# Altium project Common_AMC_Box.PrjPcb (part 4 of 6)

## Sheet Thermal_MGT.SchDoc: Temperature
size 420 x 297 mm; Author: G.Kasprowicz; CompanyName: WUT ISE; DrawnBy: G.Kasprowicz; Organization: WUT ISE; Address1: PW ISE; Address2: Nowowiejska 15/19 00-665 Warsaw; Address3: gkasprow@gmail.com; DocumentNumber: 12; Revision: 2; SheetNumber: 12; SheetTotal: 18; ModifiedBy: -; CheckedDate: -; Title2: management; DivGrp: WUT ISE; Designer: G.Kasprowicz; ModifiedDate: -; ProjectName: Sensor Box
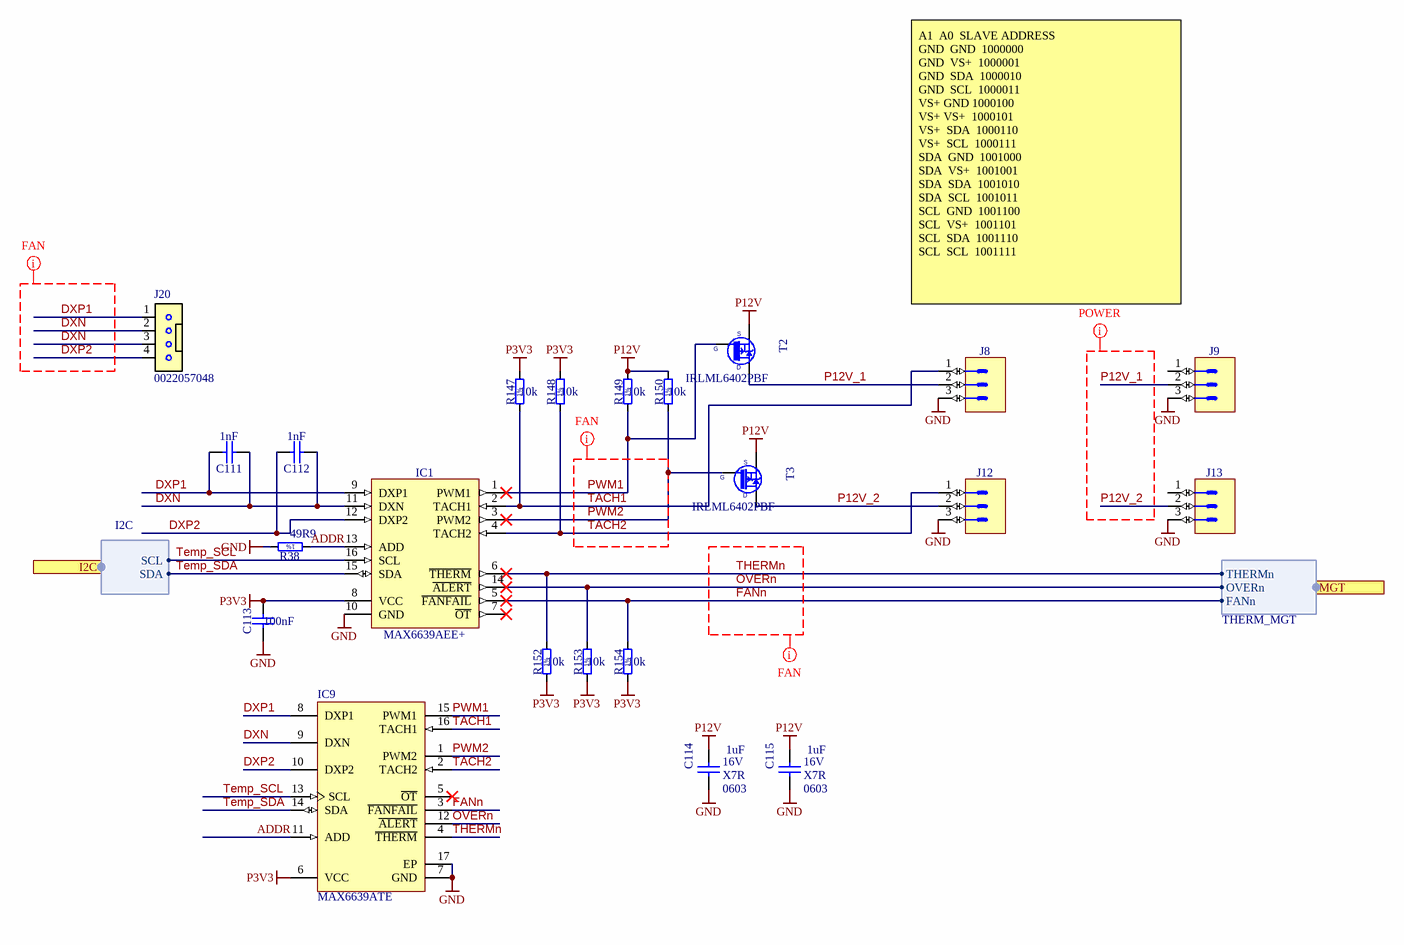
[diagram p9: Thermal_MGT.SchDoc]

### Parts
C111  1nF  [CAPC1005X55N]
C112  1nF  [CAPC1005X55N]
C113  100nF  [CAPC1005X55N]
C114  1uF  Voltage: 16V  TC: X7R  Case: 0603  [CAPC1608X87N]
C115  1uF  Voltage: 16V  TC: X7R  Case: 0603  [CAPC1608X87N]
IC1  MAX6639AEE+  [SOP63P600X175-16N]
IC9  MAX6639ATE  [MAXM-T1655-3_N]
J8  KK®  [MOLEX_22-05-7038]  (value not drawn)
J9  KK®  [MOLEX_22-05-7038]  (value not drawn)
J12  KK®  [MOLEX_22-05-7038]  (value not drawn)
J13  KK®  [MOLEX_22-05-7038]  (value not drawn)
J20  0022057048  [CON_0022057048]
R38  49R9  [RESC1005X40N]
R147  10k  [RESC1005X40N]
R148  10k  [RESC1005X40N]
R149  10k  [RESC1005X40N]
R150  10k  [RESC1005X40N]
R152  10k  [RESC1005X40N]
R153  10k  [RESC1005X40N]
R154  10k  [RESC1005X40N]
T2  IRLML6402PBF  [SOT95P237X112-3N]
T3  IRLML6402PBF  [SOT95P237X112-3N]

### Ports
I2C (harness I2C), MGT (harness THERM_MGT)

### Harnesses
I2C: SCL, SDA
THERM_MGT: OVERn, THERMn, FANn

### Nets
GND: C113.1 C114.1 C115.1 IC1.10(GND) IC9.7(GND) IC9.17(EP) J8.3 J9.3 J12.3 J13.3 R38.2
P3V3: C113.2 IC1.8(VCC) IC9.6(VCC) R147.2 R148.2 R152.1 R153.1 R154.1
P12V: C114.2 C115.2 R149.2 R150.2 T2.2(S) T3.2(S)
ADDR: IC1.13(ADD) IC9.11(ADD) R38.1
DXN: C111.1 C112.1 IC1.11(DXN) IC9.9(DXN) J20.2 J20.3
DXP1: C111.2 IC1.9(DXP1) IC9.8(DXP1) J20.1
DXP2: C112.2 IC1.12(DXP2) IC9.10(DXP2) J20.4
FANn: IC1.5(~{FANFAIL}) IC9.3(~{FANFAIL}) R154.2 ; port MGT.FANn
OVERn: IC1.14(~{ALERT}) IC9.12(~{ALERT}) R153.2 ; port MGT.OVERn
P12V_1: J8.2 J9.2 T2.3(D)
P12V_2: J12.2 J13.2 T3.3(D)
PWM1: IC1.1(PWM1) IC9.15(PWM1) R149.1 T2.1(G)
PWM2: IC1.3(PWM2) IC9.1(PWM2) R150.1 T3.1(G)
TACH1: IC1.2(TACH1) IC9.16(TACH1) J8.1 R147.1
TACH2: IC1.4(TACH2) IC9.2(TACH2) J12.1 R148.1
Temp_SCL: IC1.16(SCL) IC9.13(SCL) ; port I2C.SCL  [project net QSFP_SCL]
Temp_SDA: IC1.15(SDA) IC9.14(SDA) ; port I2C.SDA  [project net QSFP_SDA]
THERMn: IC1.6(~{THERM}) IC9.4(~{THERM}) R152.2 ; port MGT.THERMn

Not connected (* = marked no-connect by the designer): IC1 7(~{OT})*; IC9 5(~{OT})*; J9 1; J13 1

### Layout directives
net class POWER: P12V_1, P12V_2
net class FAN: DXN, DXP1, DXP2, FANn, OVERn, PWM1, PWM2, TACH1, TACH2, THERMn

### Notes on the sheet
- A1 	A0 	SLAVE ADDRESS
  GND 	GND 	1000000
  GND 	VS+ 	1000001
  GND 	SDA 	1000010
  GND 	SCL 	1000011
  VS+	GND	1000100
  VS+	VS+ 	1000101
  VS+ 	SDA 	1000110
  VS+ 	SCL 	1000111
  SDA 	GND 	1001000
  SDA 	VS+ 	1001001
  SDA 	SDA 	1001010
  SDA 	SCL 	1001011
  SCL 	GND 	1001100
  SCL 	VS+ 	1001101
  SCL 	SDA 	1001110
  SCL 	SCL 	1001111
- Project/Equipment
- Document
- Designer
- Drawn by
- Check.by
- Copyright WUT ISE 2020.
  This documentation describes Open Hardware and is licensed under the CERN OHL v.1.2. You may redistribute and modify this documentation under the terms of the CERN OHL v.1.2. (http://ohwr.org/CERNOHL). This documentation is distributed WITHOUT ANY EXPRESS OR IMPLIED WARRANTY, INCLUDING OF MERCHANTABILITY, SATISFACTORY QUALITY AND FITNESS FOR A PARTICULAR PURPOSE. Please see the CERN OHL v.1.2 for applicable conditions.
- Contact
- File
- Last Mod.
- Print Date
- Sheet
- Size
- A3
- of
- Rev
- (in symbol R0402_10K_1%_0.0625W_100PPM) 1%
- (in symbol R0402_49R9_1%_0.0625W_100PPM) 1%

### Library data of the parts
C111 C112 = CC0402_1NF_50V_10%_X7R: Non-polarised capacitor; Part Description: SMD Multilayer Chip Ceramic Capacitor; Manufacturer: GENERIC; Manufacturer1 Part Number: 223858715623; Voltage: 50V; TC: X7R; Tolerance: ±10%; Part Number: CC0402_1NF_50V_10%_X7R; Component Kind: Standard; Component Type: Standard; Pin Count: 2; Value: 1nF; Status: Not Recommended; Manufacturer Part Number: CC0402_1NF_50V_10%_X7R; Case: 0402; Mounted: Yes; Socket: No; SMD: Yes; Manufacturer1 Example: PHYCOMP; Manufacturer1 ComponentHeight: 0.55mm; HelpURL: \\cern.ch\dfs\Applications\Altium\Datasheets\CC0402_X7R_PHYCOMP.pdf; Author: CERN DEM JLC; CreateDate: 03.12.2007; LatestRevisionDate: 03.12.2007; Sense: No
C113 = CC0402_100NF_16V_10%_X5R: Non-polarised capacitor; Part Description: SMD Multilayer Chip Ceramic Capacitor; Manufacturer: GENERIC; Manufacturer1 Part Number: GRM155R61C104KA88D; Voltage: 16V; TC: X5R; Tolerance: ±10%; Part Number: CC0402_100NF_16V_10%_X5R; Component Kind: Standard; Component Type: Standard; Pin Count: 2; Value: 100nF; Status: None; Manufacturer Part Number: CC0402_100NF_16V_10%_X5R; Case: 0402; Mounted: Yes; Socket: No; SMD: Yes; Manufacturer1 Example: MURATA; Manufacturer1 ComponentHeight: 0.55mm; HelpURL: \\cern.ch\dfs\Applications\Altium\Datasheets\CC0402_X5R_MURATA_GRM.pdf; Author: CERN DEM JLC; CreateDate: 10.12.2013; LatestRevisionDate: 10.12.2013; Sense: No
C114 C115 = CC0603_1UF_16V_10%_X7R: Non-polarised capacitor; Part Description: SMD Multilayer Chip Ceramic Capacitor; Manufacturer: GENERIC; Manufacturer1 Part Number: 223824613663; Tolerance: ±10%; Table: Capacitors SMD; Part Number: CC0603_1UF_16V_10%_X7R; Component Kind: Standard; Component Type: Standard; Pin Count: 2; Value: 1uF; Status: Preferred; Manufacturer Part Number: CC0603_1uF_16V_10%_X7R; Mounted: Yes; Socket: No; SMD: Yes; Manufacturer1 Example: PHYCOMP; Manufacturer1 ComponentHeight: 0.87mm; HelpURL: \\cern.ch\dfs\Applications\Altium\Datasheets\CC0805_X5R_PHYCOMP_HC.pdf; Author: CERN DEM JLC; CreateDate: 12/3/2007; LatestRevisionDate: 12/3/2007
IC1 = MAX6639AEE+: 2-Channel Temperature Monitor with Dual, Automatic, PWM Fan-Speed Controller; Manufacturer: MAXIM; Table: Analog & Interface; Part Number: MAX6639AEE+; Component Kind: Standard; Component Type: Standard; Device: MAX6639AEE+; PackageDescription: SOP, 0.635mm pitch; 16 pin, 3.9mm W X 4.895mm L X 1.75mm H Body, IPC Medium Density; Part Description: 2-Channel Temperature Monitor with Dual, Automatic, PWM Fan-Speed Controller; Manufacturer Part Number: MAX6639AEE+; Pin Count: 16; Case: SSOP16; Mounted: Yes; Socket: No; SMD: Yes; ComponentHeight: 1.75mm; Author: CERN DEM JLC; HelpURL: \\cern.ch\dfs\Applications\Altium\Datasheets\MAX6639AEE+.pdf; CreateDate: 2012-08-15; LatestRevisionDate: 2012-08-15
IC9 = CMP-0253-00500-2: 2-Channel Temperature Monitor with Dual, Automatic, PWM Fan-Speed Controller, -40 to 125 degC, 16-Pin QFN (T1655-3); Fan Controller Functions: Remote & Local Sensor; Interface: 2-Wire/I2C/SMBus; ComponentLink1URL: http://www.maximintegrated.com/; DatasheetVersion: Rev. 2; ComponentLink2Description: Datasheet; ComponentLink2URL: http://datasheets.maximintegrated.com/en/ds/MAX6639-MAX6639F.pdf; Code_JEDEC: MO220; Fan Cntrl.: PWM; PackageReference: T1655-3; PartNumber: MAX6639ATE; ComponentLink3URL: http://pdfserv.maximintegrated.com/package_dwgs/21-0140.PDF; Mounting Technology: Surface Mount; PackageDescription: 16-Pin Thin Quad Flatpack, No Leads, Body 5 x 5 mm, Pitch 0.8 mm; ComponentLink3Description: Package Specification; Generic Part Number: MAX6639; PackageVersion: Rev. Q, 09/2011; ComponentLink1Description: Manufacturer URL
J8 J9 J12 J13 = MOLEX_22-05-7038: Connector 3 Male; Part Description: 2.54mm (.100") Pitch KK® Wire-To-Board Header, Right Angle, With Friction Lock, 3 Circuits; Manufacturer: MOLEX; PressFit: No; Part Number: MOLEX_22-05-7038; Component Kind: Standard; Component Type: Standard; Pin Count: 3; Family: KK®; Mounted: Yes; Socket: No; SMD: No; Sense: No; Status: None; Manufacturer Part Number: 22-05-7038; ComponentHeight: 5.8mm; HelpURL: \\cern.ch\dfs\Applications\Altium\Datasheets\MOLEX_22-05-7038.pdf; Author: CERN DEM JLC; CreateDate: 19.09.2012; LatestRevisionDate: 19.09.2012
J20 = CON_4_2.54_RA_key: 2.54mm crimped terminal header
R38 = R0402_49R9_1%_0.0625W_100PPM: Resistor - 1%; Part Description: General Purpose Thick Film Chip Resistor; Manufacturer: GENERIC; Manufacturer1 Part Number: 232270674999L or RC0402FR-0749R9L; TC: ±100ppm/°C; Table: Resistors SMD; Part Number: R0402_49R9_1%_0.0625W_100PPM; Component Kind: Standard; Component Type: Standard; Pin Count: 2; Value: 49R9; Status: Not recommended; Power: 0.0625W; Tolerance: ±1%; Manufacturer Part Number: R0402_49R9_1%_0.0625W_100PPM; Case: 0402; Mounted: Yes; Socket: No; SMD: Yes; Manufacturer1 Example: YAGEO PHYCOMP; Manufacturer1 ComponentHeight: 0.4mm; HelpURL: \\cern.ch\dfs\Applications\Altium\Datasheets\R0402_Phycomp_RC0402.pdf; Author: CERN DEM JLC; CreateDate: 2012-10-24; LatestRevisionDate: 2012-10-24
R147-R150 R152-R154 = R0402_10K_1%_0.0625W_100PPM: Resistor - 1%; Part Description: General Purpose Thick Film Chip Resistor; Manufacturer: GENERIC; Manufacturer1 Part Number: 232270671003L; TC: ±100ppm/°C; Table: Resistors SMD; Part Number: R0402_10K_1%_0.0625W_100PPM; Component Kind: Standard; Component Type: Standard; Pin Count: 2; Value: 10k; Status: Not recommended; Power: 0.0625W; Tolerance: ±1%; Manufacturer Part Number: R0402_10K_1%_0.0625W_100PPM; Case: 0402; Mounted: Yes; Socket: No; SMD: Yes; Manufacturer1 Example: YAGEO PHYCOMP; Manufacturer1 ComponentHeight: 0.4mm; HelpURL: \\cern.ch\dfs\Applications\Altium\Datasheets\R0402_Phycomp_RC0402.pdf; Author: CERN DEM JLC; CreateDate: 2007-12-03; LatestRevisionDate: 2012-10-17
T2 T3 = IRLML6402PBF: P-CHANNEL MOSFET WITH ZENER DIODE; Part Description: -20V -3.7A P-Channel HEXFET® Power MOSFET; Manufacturer: INTERNATIONAL RECTIFIER; PressFit: No; Bonding: No; Part Number: IRLML6402PBF; Component Kind: Standard; Component Type: Standard; Device: IRLML6402PBF; PackageDescription: SOT, 0.95mm, pitch; 3 pin,1.30mm W X 2.92mm L X 1.12mm H body, IPC Medium Density; Manufacturer Part Number: IRLML6402PBF; Pin Count: 3; Case: SOT23-3; Mounted: Yes; Socket: No; SMD: Yes; Sense: No; ComponentHeight: 1.12mm; HelpURL: \\cern.ch\dfs\Applications\Altium\Datasheets\IRLML6402PBF.pdf; Author: CERN DEM JLC; CreateDate: 8/29/2011; LatestRevisionDate: 8/29/2011

## Sheet CPU_ETH.SchDoc: Title
size 420 x 297 mm; Author: G.Kasprowicz; CompanyName: WUT ISE; DrawnBy: G.Kasprowicz; Organization: WUT ISE; Address1: PW ISE; Address2: Nowowiejska 15/19 00-665 Warsaw; Address3: gkasprow@gmail.com; DocumentNumber: 4; Revision: 2; SheetNumber: 4; SheetTotal: 18; ModifiedBy: -; CheckedDate: -; Title2: Title 2; DivGrp: WUT ISE; Designer: G.Kasprowicz; ModifiedDate: -; ProjectName: Sensor Box
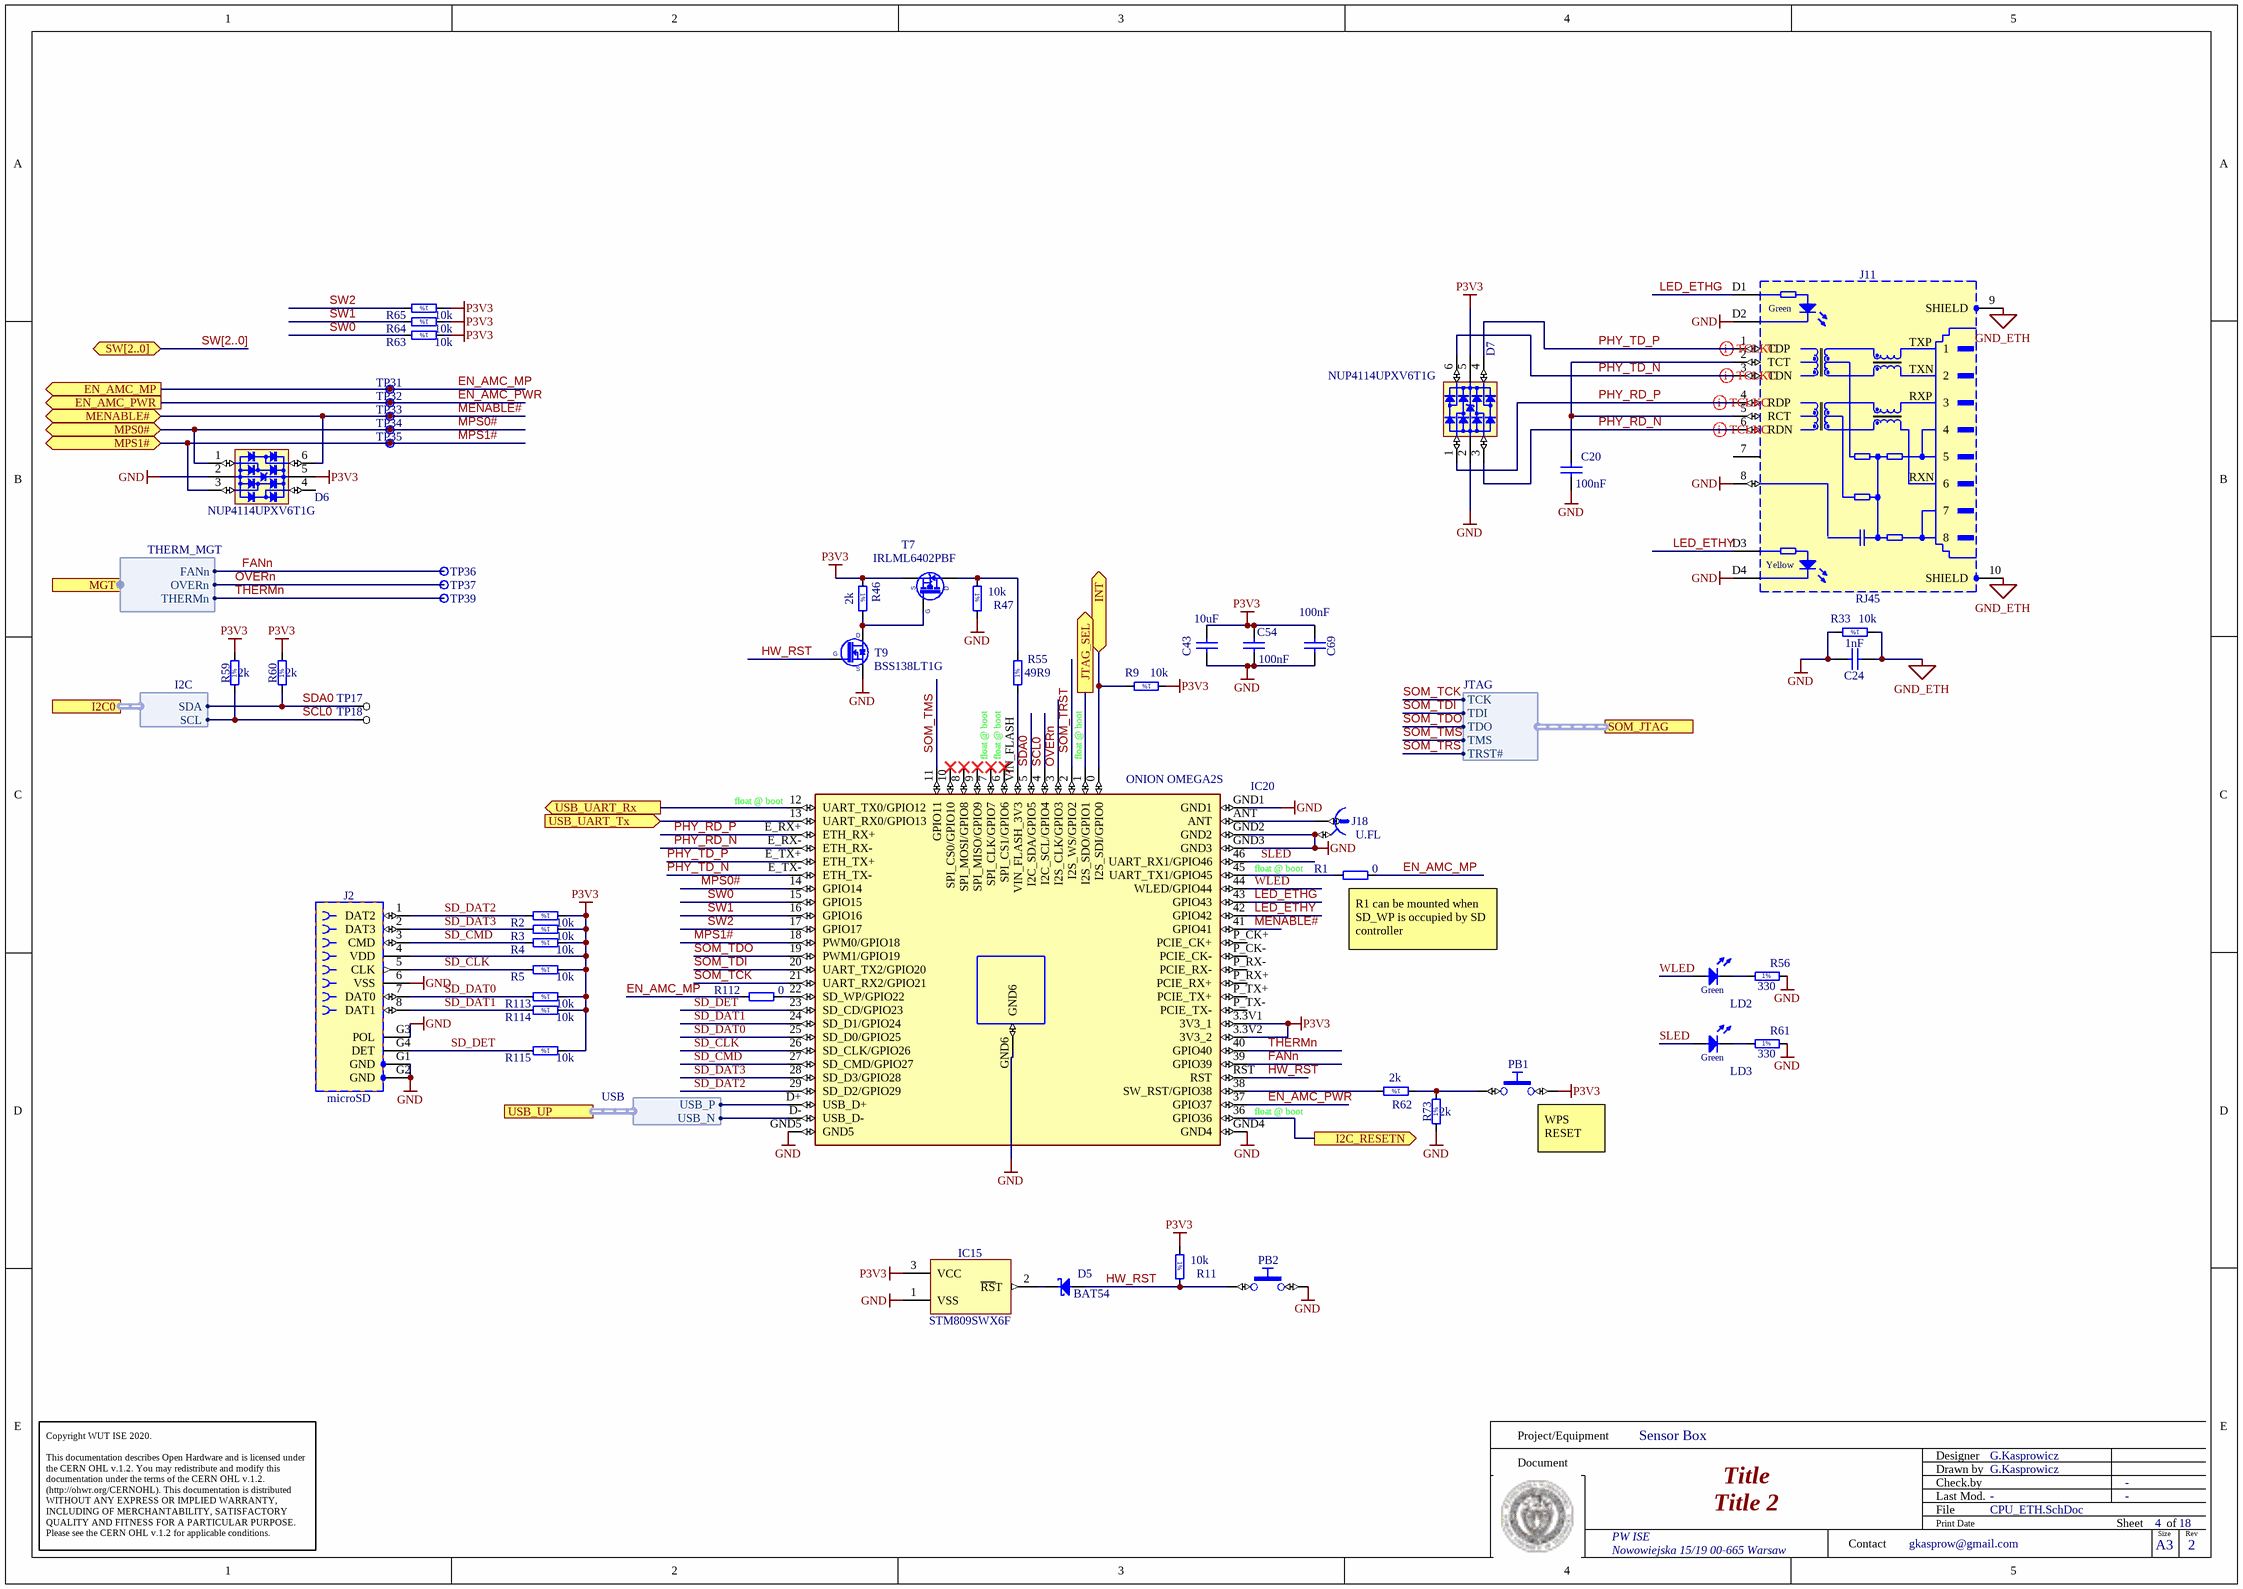
[diagram p10: CPU_ETH.SchDoc]

### Parts
(Parts that share a designator on the sheet are numbered #1, #2 ... from top to bottom, then left to right.)
C20  100nF  [CAPC1005X55N]
C24  1nF  [CAPC1005X55N]
C43  10uF  [CAPC2012X135N]
C54  100nF  [CAPC1005X55N]
C69  100nF  [CAPC1005X55N]
D5  BAT54  [SOT95P240X130-3N]
D6  NUP4114UPXV6T1G  [SOTFL50P160X60-6N]
D7  NUP4114UPXV6T1G  [SOTFL50P160X60-6N]
IC15  STM809SWX6F  [SOT95P237X112-3N]
IC20  ONION OMEGA2S  [OMEGA2S_PADS]
J2  microSD  [MOLEX_47309-2651]
J11  RJ45  [TYCO_5-6605308-1]
J18  U.FL  [HIROSE_U.FL-R-SMT-1(10)]
LD2  LED_AVAGO_HSME-C120  [LED_AVAGO_HSME-C120]  (value not drawn)
LD3  LED_AVAGO_HSME-C120  [LED_AVAGO_HSME-C120]  (value not drawn)
PB1  Push Button  [PB_TYCO_FSMSM]  (value not drawn)
PB2  Push Button  [PB_TYCO_FSMSM]  (value not drawn)
R1#2  0  [RESC1005X40N]
R2#2  10k  [RESC1005X40N]
R3#2  10k  [RESC1005X40N]
R4#2  10k  [RESC1005X40N]
R5#2  10k  [RESC1005X40N]
R9  10k  [RESC1005X40N]
R11  10k  [RESC1005X40N]
R33  10k  [RESC1005X40N]
R46  2k  [RESC1005X40N]
R47  10k  [RESC1005X40N]
R55  49R9  [RESC1005X40N]
R56  330  [RESC1608X55N]
R59  2k  [RESC1005X40N]
R60  2k  [RESC1005X40N]
R61  330  [RESC1608X55N]
R62  2k  [RESC1005X40N]
R63  10k  [RESC1005X40N]
R64  10k  [RESC1005X40N]
R65  10k  [RESC1005X40N]
R73  2k  [RESC1005X40N]
R112  0  [RESC1005X40N]
R113  10k  [RESC1005X40N]
R114  10k  [RESC1005X40N]
R115  10k  [RESC1005X40N]
T7  IRLML6402PBF  [SOT95P237X112-3N]
T9  BSS138LT1G  [SOT95P240X110-3N]
TP17  TP  [TP]  (value not drawn)
TP18  TP  [TP]  (value not drawn)
TP31  Test Point  [TPS127]  (value not drawn)
TP32  Test Point  [TPS127]  (value not drawn)
TP33  Test Point  [TPS127]  (value not drawn)
TP34  Test Point  [TPS127]  (value not drawn)
TP35  Test Point  [TPS127]  (value not drawn)
TP36  Test Point  [TPS127]  (value not drawn)
TP37  Test Point  [TPS127]  (value not drawn)
TP39  Test Point  [TPS127]  (value not drawn)

### Ports
EN_AMC_MP (out), EN_AMC_PWR (out), I2C0 (harness I2C), I2C_RESETN (out), INT (bidir), JTAG_SEL (out), MENABLE# (bidir), MGT (harness THERM_MGT), MPS0# (bidir), MPS1# (bidir), SOM_JTAG (harness JTAG), SW[2..0] (bidir), USB_UART_Rx (out), USB_UART_Tx (in), USB_UP (harness USB)

### Harnesses
THERM_MGT: OVERn, THERMn, FANn
I2C: SCL, SDA
JTAG: TCK, TDI, TDO, TMS, TRST#
USB: USB_N, USB_P

### Nets
GND: C20.1 C24.2 C43.2 C54.1 C69.1 D6.2(GND) D7.2(GND) IC15.1(VSS) IC20.GND1 IC20.GND2 IC20.GND3 IC20.GND4 IC20.GND5 IC20.GND6 J2.6(VSS) J2.G1(GND) J2.G2(GND) J2.G3(POL) J11.8 J11.D2 J11.D4 J18.2 PB2.2 R33.2 R47.2 R56.2 R61.2 R73.1 T9.2(S)
GND_ETH: C24.1 J11.9(SHIELD) J11.10(SHIELD) R33.1
P3V3: C43.1 C54.2 C69.2 D6.5(VBUS) D7.5(VBUS) IC15.3(VCC) IC20.3.3V1(3V3_1) IC20.3.3V2(3V3_2) J2.4(VDD) PB1.2 R2#2.1 R3#2.1 R4#2.1 R5#2.1 R9.1 R11.1 R46.1 R59.2 R60.2 R63.1 R64.1 R65.1 R113.1 R114.1 R115.1 T7.2(S)
EN_AMC_MP: R1#2.2 R112.1 TP31.1 ; port EN_AMC_MP
EN_AMC_PWR: IC20.37(GPIO37) TP32.1 ; port EN_AMC_PWR
FANn: IC20.39(GPIO39) TP36.1 ; port MGT.FANn
HW_RST: D5.1(A) IC20.RST PB2.1 R11.2 T9.1(G)
LED_ETHG: IC20.43(GPIO43) J11.D1
LED_ETHY: IC20.42(GPIO42) J11.D3
MENABLE#: D6.6(I/O4) IC20.41(GPIO41) TP33.1 ; port MENABLE#
MPS0#: D6.1(I/O1) IC20.14(GPIO14) TP34.1 ; port MPS0#
MPS1#: D6.3(I/O2) IC20.18(PWM0/GPIO18) TP35.1 ; port MPS1#
OVERn: IC20.3(I2S_CLK/GPIO3) TP37.1 ; port MGT.OVERn
PHY_RD_N: D7.3(I/O2) IC20.E_RX-(ETH_RX-) J11.6(RDN)
PHY_RD_P: D7.1(I/O1) IC20.E_RX+(ETH_RX+) J11.4(RDP)
PHY_TD_N: D7.6(I/O4) IC20.E_TX-(ETH_TX-) J11.3(TDN)
PHY_TD_P: D7.4(I/O3) IC20.E_TX+(ETH_TX+) J11.1(TDP)
SCL0: IC20.4(I2C_SCL/GPIO4) R59.1 TP18.1 ; port I2C0.SCL
SD_CLK: IC20.26(SD_CLK/GPIO26) J2.5(CLK) R5#2.2
SD_CMD: IC20.27(SD_CMD/GPIO27) J2.3(CMD) R4#2.2
SD_DAT0: IC20.25(SD_D0/GPIO25) J2.7(DAT0) R113.2
SD_DAT1: IC20.24(SD_D1/GPIO24) J2.8(DAT1) R114.2
SD_DAT2: IC20.29(SD_D2/GPIO29) J2.1(DAT2) R2#2.2
SD_DAT3: IC20.28(SD_D3/GPIO28) J2.2(DAT3) R3#2.2
SD_DET: IC20.23(SD_CD/GPIO23) J2.G4(DET) R115.2
SDA0: IC20.5(I2C_SDA/GPIO5) R60.1 TP17.1 ; port I2C0.SDA
SLED: IC20.46(UART_RX1/GPIO46) LD3.2(A)
SOM_TCK: IC20.21(UART_RX2/GPIO21) ; port SOM_JTAG.TCK
SOM_TDI: IC20.20(UART_TX2/GPIO20) ; port SOM_JTAG.TDI
SOM_TDO: IC20.19(PWM1/GPIO19) ; port SOM_JTAG.TDO
SOM_TMS: IC20.11(GPIO11) ; port SOM_JTAG.TMS
SOM_TRST: IC20.2(I2S_WS/GPIO2) ; port SOM_JTAG.TRST#
SW0: IC20.15(GPIO15) R63.2
SW1: IC20.16(GPIO16) R64.2
SW2: IC20.17(GPIO17) R65.2
THERMn: IC20.40(GPIO40) TP39.1 ; port MGT.THERMn
USB0_N: IC20.D-(USB_D-) ; port USB_UP.USB_N
USB0_P: IC20.D+(USB_D+) ; port USB_UP.USB_P
WLED: IC20.44(WLED/GPIO44) LD2.2(A)
NetC20_2: C20.2 J11.2(TCT) J11.5(RCT)
NetD5_3: D5.3(C) IC15.2(~{RS}T)
NetIC7_2: IC20.13(UART_RX0/GPIO13) ; port USB_UART_Tx
NetIC7_9: IC20.12(UART_TX0/GPIO12) ; port USB_UART_Rx
NetIC16_24: IC20.36(GPIO36) ; port I2C_RESETN
NetIC17_1: IC20.1(I2S_SDO/GPIO1) ; port JTAG_SEL
NetIC20_0: IC20.0(I2S_SDI/GPIO0) R9.2 ; port INT
NetIC20_22: IC20.22(SD_WP/GPIO22) R112.2
NetIC20_38: IC20.38(SW_RST/GPIO38) R62.2
NetIC20_45: IC20.45(UART_TX1/GPIO45) R1#2.1
NetIC20_ANT: IC20.ANT J18.1
NetIC20_VIN_FLASH: IC20.VIN_FLASH(VIN_FLASH_3V3) R55.1
NetLD2_1: LD2.1(C) R56.1
NetLD3_1: LD3.1(C) R61.1
NetPB1_1: PB1.1 R62.1 R73.2
NetR46_2: R46.2 T7.1(G) T9.3(D)
NetR47_1: R47.1 R55.2 T7.3(D)

Not connected (* = marked no-connect by the designer): D6 4(I/O3); IC20 6(SPI_CS1/GPIO6)* 7(SPI_CLK/GPIO7)* 8(SPI_MOSI/GPIO8)* 9(SPI_MISO/GPIO9)* 10(SPI_CS0/GPIO10)* P_CK+(PCIE_CK+) P_CK-(PCIE_CK-) P_RX+(PCIE_RX+) P_RX-(PCIE_RX-) P_TX+(PCIE_TX+) P_TX-(PCIE_TX-); J11 7

### Buses and harness runs
bus SW[2..0] = port SW[2..0]

### Layout directives
differential pair: PHY_RD_N, PHY_RD_P, PHY_TD_N, PHY_TD_P

### Notes on the sheet
- (near IC20) float @ boot
- float @ boot
- (near R1#2) R1 can be mounted when SD_WP is occupied by SD controller
- (near PB1) WPS RESET
- Project/Equipment
- Document
- Designer
- Drawn by
- Check.by
- Copyright WUT ISE 2020.
  This documentation describes Open Hardware and is licensed under the CERN OHL v.1.2. You may redistribute and modify this documentation under the terms of the CERN OHL v.1.2. (http://ohwr.org/CERNOHL). This documentation is distributed WITHOUT ANY EXPRESS OR IMPLIED WARRANTY, INCLUDING OF MERCHANTABILITY, SATISFACTORY QUALITY AND FITNESS FOR A PARTICULAR PURPOSE. Please see the CERN OHL v.1.2 for applicable conditions.
- Contact
- File
- Last Mod.
- Print Date
- Sheet
- Size
- A3
- of
- Rev
- (in symbol R0402_2K_1%_0.0625W_100PPM) 1%
- (in symbol R0402_10K_1%_0.0625W_100PPM) 1%
- (in symbol R0402_49R9_1%_0.0625W_100PPM) 1%
- (in symbol R0603_330R_1%_0.1W_100PPM) 1%
- (in symbol TYCO_5-6605308-1) Green; TXP; TXN; RXP; RXN; Yellow

### Library data of the parts
C20 C54 C69 = CC0402_100NF_16V_10%_X5R: as C113 on sheet Thermal_MGT; Part Number: CC0402_100NF_16V_10%_X5R; Component Kind: Standard; Component Type: Standard; Pin Count: 2; Value: 100nF; Status: None; Manufacturer Part Number: CC0402_100NF_16V_10%_X5R; Case: 0402; Mounted: Yes; Socket: No; SMD: Yes; Manufacturer1 Example: MURATA; Manufacturer1 ComponentHeight: 0.55mm; HelpURL: \\cern.ch\dfs\Applications\Altium\Datasheets\CC0402_X5R_MURATA_GRM.pdf; Author: CERN DEM JLC; CreateDate: 10.12.2013; LatestRevisionDate: 10.12.2013; Sense: No
C24 = CC0402_1NF_50V_10%_X7R: as C111 on sheet Thermal_MGT; Part Number: CC0402_1NF_50V_10%_X7R; Component Kind: Standard; Component Type: Standard; Pin Count: 2; Value: 1nF; Status: Not Recommended; Manufacturer Part Number: CC0402_1NF_50V_10%_X7R; Case: 0402; Mounted: Yes; Socket: No; SMD: Yes; Manufacturer1 Example: PHYCOMP; Manufacturer1 ComponentHeight: 0.55mm; HelpURL: \\cern.ch\dfs\Applications\Altium\Datasheets\CC0402_X7R_PHYCOMP.pdf; Author: CERN DEM JLC; CreateDate: 03.12.2007; LatestRevisionDate: 03.12.2007; Sense: No
C43 = CC0805_10UF_10V_10%_X7R: Non-polarised capacitor; Part Description: SMD Multilayer Chip Ceramic Capacitor; Manufacturer: GENERIC; Manufacturer1 Part Number: GRM21BR71A106KE51L; Voltage: 10V; TC: X7R; Tolerance: ±10%; Table: Capacitors SMD; Part Number: CC0805_10UF_10V_10%_X7R; Component Kind: Standard; Component Type: Standard; Pin Count: 2; Value: 10uF; Status: Preferred; Manufacturer Part Number: CC0805_10UF_10V_10%_X7R; Case: 0805; Mounted: Yes; Socket: No; SMD: Yes; Manufacturer1 Example: MURATA; Manufacturer1 ComponentHeight: 1.35mm; HelpURL: \\cern.ch\dfs\Applications\Altium\Datasheets\CC0805_X7R_MURATA.pdf; Author: CERN DEM JLC; CreateDate: 2012-04-30; LatestRevisionDate: 2012-04-30
D5 = BAT54: Diode Schottky  Anode Pin 1 Cathode Pin 3 (Pas de pin 2); Part Description: Single Small Signal Schottky Diode; Manufacturer: FAIRCHILD SEMICONDUCTOR; Voltage: 30V; Power: 200mA; Table: Diodes; Part Number: BAT54; Component Kind: Standard; Component Type: Standard; Device: BAT54; PackageDescription: SOT23 3-Leads, Pitch 0.95mm - Body 1.3x2.9mm, IPC Medium Density; Manufacturer Part Number: BAT54; Pin Count: 3; Case: SOT23-3; Mounted: Yes; Socket: No; SMD: Yes; ComponentHeight: 1.30mm; HelpURL: \\cern.ch\dfs\Applications\Altium\Datasheets\BAT54.pdf; Author: CERN DEM JLC; CreateDate: 2009-09-17; LatestRevisionDate: 2010-05-27
D6 D7 = NUP4114UPXV6T1G: Part Description: ESD Protection Diodes Array (8kV) with Low Clamping Voltage; Manufacturer: ON SEMICONDUCTOR; Voltage: 5.5V; PressFit: No; Bonding: No; Part Number: NUP4114UPXV6T1G; Component Kind: Standard; Component Type: Standard; Device: NUP4114UPXV6T1G; PackageDescription: SOTFL (SOT666, SOT563,), 0.50mm, Pitch; 6 Pin, 1.20mm W X 1.60mm L X 0.60mm H Body, IPC Medium Density; Manufacturer Part Number: NUP4114UPXV6T1G; Pin Count: 8; Mounted: Yes; Socket: No; SMD: Yes; Sense: No; ComponentHeight: 1.75mm; HelpURL: \\cern.ch\dfs\Applications\Altium\Datasheets\NUP4114UPXV6T1G.pdf; Author: CERN DEM JLC; CreateDate: 05.12.2012; LatestRevisionDate: 05.12.2012
IC15 = STM809SWX6F: 3-Pin Microprocessor Reset Circuit; Part Description: 3-Pin Microprocessor Reset Circuit, Reset Threshold Voltage 2.85-3.00V; Manufacturer: ST MICROELECTRONICS; PressFit: No; Bonding: No; Part Number: STM809SWX6F; Component Kind: Standard; Component Type: Standard; Device: STM809SWX6F; PackageDescription: SOT, 0.95mm, pitch; 3 pin,1.30mm W X 2.92mm L X 1.12mm H body, IPC Medium Density; Manufacturer Part Number: STM809SWX6F; Pin Count: 3; Case: SOT23; Mounted: Yes; Socket: No; SMD: Yes; Sense: No; ComponentHeight: 1.12mm; HelpURL: \\cern.ch\dfs\Applications\Altium\Datasheets\STM809SWX6F.pdf; Author: CERN DEM JMW; CreateDate: 11.08.2015; LatestRevisionDate: 11.08.2015
IC20 = MOD_OMEGA2S: MediaTek Transceiver; 802.11 b/g/n _Wi-Fi, WiFi, WLAN_ For Use With MT7688; MF: Onion; SnapEDA_Link: https://www.snapeda.com/parts/OMEGA2S/Onion/view-part/3600410/?ref=snap; MP: OMEGA2S; Price: None; Value: *; Availability: Unavailable; Package: Module Onion
J2 = MOLEX_47309-2651: MicroSD Card Header with Detect Switch; Part Description: 1.10mm Pitch microSD Card Header with Detect Switch; Manufacturer: MOLEX; PressFit: No; Part Number: MOLEX_47309-2651; Component Kind: Standard; Component Type: Standard; Pin Count: 12; Family: microSD; Mounted: Yes; Socket: No; SMD: Yes; Sense: No; Status: None; Manufacturer Part Number: 47309-2651; ComponentHeight: 2.65mm; HelpURL: \\cern.ch\dfs\Applications\Altium\Datasheets\MOLEX_47309-2651.pdf; Author: CERN DEM JMW; CreateDate: 29.06.2017; LatestRevisionDate: 29.06.2017
J11 = TYCO_5-6605308-1: 1 Port, Yellow/Green LEDs, RJ45 10/100Base-T Ethernet, Mag45 Connector Module With Integrated Magnetics; Manufacturer: TYCO ELECTRONICS; PressFit: No; Part Number: TYCO_5-6605308-1; Component Kind: Standard; Component Type: Standard; Pin Count: 14; Family: RJ45; Mounted: Yes; Socket: No; SMD: No; Sense: No; Status: None; Part Description: 1 Port, Yellow/Green LEDs, RJ45 10/100Base-T Ethernet, Mag45 Connector Module With Integrated Magnetics; Manufacturer Part Number: 5-6605308-1; ComponentHeight: 15.24mm; HelpURL: \\cern.ch\dfs\Applications\Altium\Datasheets\TYCO_5-6605308-1.pdf; Author: CERN DEM JLC; CreateDate: 23.08.2012; LatestRevisionDate: 23.08.2012
J18 = HIROSE_U.FL-R-SMT-1(10): Part Description: Up to 6GHz Ultra Small Surface Mount Male Coaxial Connectors U.FL Series; Manufacturer: HIROSE (HRS); PressFit: No; Part Number: HIROSE_U.FL-R-SMT-1(10); Component Kind: Standard; Component Type: Standard; Pin Count: 2; Family: U.FL; Mounted: Yes; Socket: No; SMD: Yes; Sense: No; Status: None; Manufacturer Part Number: U.FL-R-SMT-1(10); ComponentHeight: 1.25mm; HelpURL: \\cern.ch\dfs\Applications\Altium\Datasheets\HIROSE_U.FL-R-SMT-1(10).pdf; Author: CERN DEM JLC; CreateDate: 24.03.2010; LatestRevisionDate: 24.03.2010
LD2 LD3 = LED_AVAGO_HSME-C120: LED Green 1C 2A; Part Description: High Performance Right Angle Chip Green LED; Manufacturer: AVAGO TECHNOLOGIES; Table: LEDs & Displays; Part Number: LED_AVAGO_HSME-C120; Component Kind: Standard; Component Type: Standard; Color: Green; PackageDescription: Green Chip LED, 2-Leads, Body 1.7x1.1mm, Side Emitting Package; Manufacturer Part Number: HSME-C120; Pin Count: 2; Mounted: Yes; Socket: No; SMD: Yes; ComponentHeight: 0.7mm; HelpURL: \\cern.ch\dfs\Applications\Altium\Datasheets\LED_AVAGO_HSME-C120.pdf; ComponentLink1URL: \\cern.ch\dfs\Applications\Altium\Datasheets\LED_AVAGO_HSME-C110_DESIGN-GUIDE.pdf; ComponentLink1Description: Design Guide; Author: CERN DEM JMW; CreateDate: 2009-07-22; LatestRevisionDate: 2012-06-20
PB1 PB2 = PB_TYCO_FSMSM: Push-Button Switch SPDT; Part Description: 12VDC 50mA SPST Tactile  Push-Button Switch; Manufacturer: TYCO ELECTRONICS; Manufacturer Part Number: FSMSM or 1437566-3; PressFit: No; Part Number: PB_TYCO_FSMSM; Component Kind: Standard; Component Type: Standard; Pin Count: 2; PackageDescription: Body 3.5x6.0mm, Pushbutton Switch,  TYCO ALCOSWITCH FSMSM Serie; Family: Push Button; Mounted: Yes; Socket: No; SMD: Yes; Sense: No; Status: None; ComponentHeight: 4.3mm; HelpURL: \\cern.ch\dfs\Applications\Altium\Datasheets\PB_TYCO_FSMSM.pdf; Author: CERN DEM JLC; CreateDate: 30.06.2008; LatestRevisionDate: 21.06.2012
R1#2 R112 = R0402_0R_JUMPER: Resistor; Part Description: 1A (0.05R Max DC Resistance) Zero Ohm Jumper; Manufacturer: GENERIC; Manufacturer1 Part Number: 232270591001L; PressFit: No; Part Number: R0402_0R_JUMPER; Component Kind: Standard; Component Type: Standard; Pin Count: 2; Value: 0; Status: Not Recommended; Manufacturer Part Number: R0402_0R_JUMPER; Case: 0402; Mounted: Yes; Socket: No; SMD: Yes; Manufacturer1 Example: YAGEO PHYCOMP; Manufacturer1 ComponentHeight: 0.4mm; HelpURL: \\cern.ch\dfs\Applications\Altium\Datasheets\R0402_Phycomp_RC0402.pdf; Author: CERN DEM JLC; CreateDate: 03.12.2007; LatestRevisionDate: 17.10.2012; Sense: No
R2#2 R3#2 R4#2 R5#2 R9 R11 R33 R47 R63-R65 R113-R115 = R0402_10K_1%_0.0625W_100PPM: as R147-R150 on sheet Thermal_MGT; Part Number: R0402_10K_1%_0.0625W_100PPM; Component Kind: Standard; Component Type: Standard; Pin Count: 2; Value: 10k; Status: Not recommended; Power: 0.0625W; Tolerance: ±1%; Manufacturer Part Number: R0402_10K_1%_0.0625W_100PPM; Case: 0402; Mounted: Yes; Socket: No; SMD: Yes; Manufacturer1 Example: YAGEO PHYCOMP; Manufacturer1 ComponentHeight: 0.4mm; HelpURL: \\cern.ch\dfs\Applications\Altium\Datasheets\R0402_Phycomp_RC0402.pdf; Author: CERN DEM JLC; CreateDate: 2007-12-03; LatestRevisionDate: 2012-10-17
R46 R59 R60 R62 R73 = R0402_2K_1%_0.0625W_100PPM: Resistor - 1%; Part Description: General Purpose Thick Film Chip Resistor; Manufacturer: GENERIC; Manufacturer1 Part Number: 232270672002L; TC: ±100ppm/°C; PressFit: No; Part Number: R0402_2K_1%_0.0625W_100PPM; Component Kind: Standard; Component Type: Standard; Pin Count: 2; Value: 2k; Status: Not Recommended; Power: 0.0625W; Tolerance: ±1%; Manufacturer Part Number: R0402_2K_1%_0.0625W_100PPM; Case: 0402; Mounted: Yes; Socket: No; SMD: Yes; Manufacturer1 Example: YAGEO PHYCOMP; Manufacturer1 ComponentHeight: 0.4mm; HelpURL: \\cern.ch\dfs\Applications\Altium\Datasheets\R0402_Phycomp_RC0402.pdf; Author: CERN DEM JLC; CreateDate: 03.12.2007; LatestRevisionDate: 17.10.2012; Sense: No
R55 = R0402_49R9_1%_0.0625W_100PPM: as R38 on sheet Thermal_MGT; Part Number: R0402_49R9_1%_0.0625W_100PPM; Component Kind: Standard; Component Type: Standard; Pin Count: 2; Value: 49R9; Status: Not recommended; Power: 0.0625W; Tolerance: ±1%; Manufacturer Part Number: R0402_49R9_1%_0.0625W_100PPM; Case: 0402; Mounted: Yes; Socket: No; SMD: Yes; Manufacturer1 Example: YAGEO PHYCOMP; Manufacturer1 ComponentHeight: 0.4mm; HelpURL: \\cern.ch\dfs\Applications\Altium\Datasheets\R0402_Phycomp_RC0402.pdf; Author: CERN DEM JLC; CreateDate: 2012-10-24; LatestRevisionDate: 2012-10-24
R56 R61 = R0603_330R_1%_0.1W_100PPM: Resistor - 1%; Part Description: General Purpose Thick Film Chip Resistor; Manufacturer: GENERIC; Manufacturer1 Part Number: NRC06F3300TRF; Power: 0.1W; TC: ±100ppm/°C; Table: Resistors SMD; Part Number: R0603_330R_1%_0.1W_100PPM; Component Kind: Standard; Component Type: Standard; Pin Count: 2; Value: 330; Status: Preferred; Tolerance: ±1%; Manufacturer Part Number: R0603_330R_1%_0.1W_100PPM; Case: 0603; Mounted: Yes; Socket: No; SMD: Yes; Manufacturer1 Example: NIC COMPONENT; Manufacturer1 ComponentHeight: 0.55mm; HelpURL: \\cern.ch\dfs\Applications\Altium\Datasheets\R0603_NIC_NRC.pdf; Author: CERN DEM JLC; CreateDate: 2007-12-03; LatestRevisionDate: 2008-03-13
T7 = IRLML6402PBF: as T2 on sheet Thermal_MGT; Part Number: IRLML6402PBF; Component Kind: Standard; Component Type: Standard; Device: IRLML6402PBF; PackageDescription: SOT, 0.95mm, pitch; 3 pin,1.30mm W X 2.92mm L X 1.12mm H body, IPC Medium Density; Manufacturer Part Number: IRLML6402PBF; Pin Count: 3; Case: SOT23-3; Mounted: Yes; Socket: No; SMD: Yes; Sense: No; ComponentHeight: 1.12mm; HelpURL: \\cern.ch\dfs\Applications\Altium\Datasheets\IRLML6402PBF.pdf; Author: CERN DEM JLC; CreateDate: 8/29/2011; LatestRevisionDate: 8/29/2011
T9 = BSS138LT1G: N-CHANNEL MOSFET WITH DIODE; Part Description: 50V 200mA N-Channel Enhancement Mode Field-Effect Transistor; Manufacturer: ON SEMICONDUCTOR; PressFit: No; Bonding: No; Part Number: BSS138LT1G; Component Kind: Standard; Component Type: Standard; Device: BSS138LT1G; PackageDescription: SOT23 3-Leads, Pitch 0.95mm - Body 1.4x3mm, IPC Medium Density; Manufacturer Part Number: BSS138LT1G; Pin Count: 3; Case: SOT23-3; Mounted: Yes; Socket: No; SMD: Yes; Sense: No; ComponentHeight: 1.11mm; HelpURL: \\cern.ch\dfs\Applications\Altium\Datasheets\BSS138LT1G.pdf; Author: CERN DEM JLC; CreateDate: 3/23/2009; LatestRevisionDate: 3/23/2009
TP17 TP18 = TP: Testpoint
TP31-TP37 TP39 = SMD_PAD_1.27X1.27MM: Part Description: 1.27mm x 1.27mm PCB Copper Area (SMD Test Point); Mounted: No; Part Number: SMD_PAD_1.27X1.27MM; Component Kind: Standard (No BOM); Component Type: Standard (No BOM); Pin Count: 1; Family: Test Point; Socket: No; SMD: Yes; Sense: No; Status: None; ComponentHeight: 0mm; HelpURL: Undefined; Author: CERN DEM JLC; CreateDate: 12.01.2008; LatestRevisionDate: 12.01.2008; PackageDescription: 1.27mm x 1.27mm PCB Copper Area (SMD Test Point)

## Sheet LCD.SchDoc: LCD & keyboard
size 420 x 297 mm; Author: G.Kasprowicz; CompanyName: WUT ISE; DrawnBy: G.Kasprowicz; Organization: WUT ISE; Address1: PW ISE; Address2: Nowowiejska 15/19 00-665 Warsaw; Address3: gkasprow@gmail.com; DocumentNumber: 8; Revision: 2; SheetNumber: 8; SheetTotal: 18; ModifiedBy: -; CheckedDate: -; Title2: Connector; DivGrp: WUT ISE; Designer: G.Kasprowicz; ModifiedDate: -; ProjectName: Sensor Box
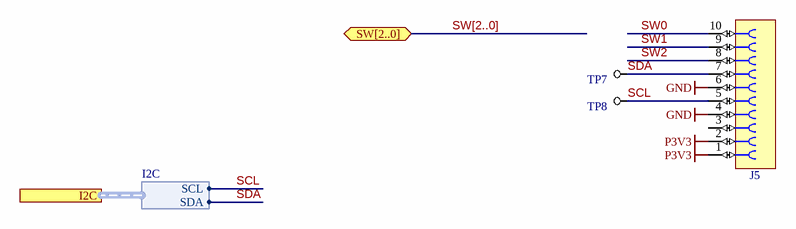
[diagram p11: LCD.SchDoc]

### Parts
J5  FFC  [WURTH_686 110 144 22]  (value not drawn)
TP7  TP  [TP]  (value not drawn)
TP8  TP  [TP]  (value not drawn)

### Ports
I2C (harness I2C), SW[2..0] (bidir)

### Harnesses
I2C: SCL, SDA

### Nets
GND: J5.4 J5.6
P3V3: J5.1 J5.2
SCL: J5.5 TP8.1 ; port I2C.SCL  [project net QSFP_SCL]
SDA: J5.7 TP7.1 ; port I2C.SDA  [project net QSFP_SDA]
SW0: J5.10
SW1: J5.9
SW2: J5.8

Not connected (* = marked no-connect by the designer): J5 3

### Buses and harness runs
bus SW[2..0] = port SW[2..0]

### Notes on the sheet
- Project/Equipment
- Document
- Designer
- Drawn by
- Check.by
- Copyright WUT ISE 2020.
  This documentation describes Open Hardware and is licensed under the CERN OHL v.1.2. You may redistribute and modify this documentation under the terms of the CERN OHL v.1.2. (http://ohwr.org/CERNOHL). This documentation is distributed WITHOUT ANY EXPRESS OR IMPLIED WARRANTY, INCLUDING OF MERCHANTABILITY, SATISFACTORY QUALITY AND FITNESS FOR A PARTICULAR PURPOSE. Please see the CERN OHL v.1.2 for applicable conditions.
- Contact
- File
- Last Mod.
- Print Date
- Sheet
- Size
- A3
- of
- Rev

### Library data of the parts
J5 = WURTH_686 110 144 22: Connector 10 Female; Part Description: 10 Contacts, Pitch 1mm, SMT Connector, ZIF Horizontal Bottom Contact WR-FPC; Manufacturer: WURTH ELEKTRONIK; PressFit: No; Part Number: WURTH_686 110 144 22; Component Kind: Standard; Component Type: Standard; Pin Count: 10; Family: FFC; Mounted: Yes; Socket: No; SMD: Yes; Sense: No; Status: None; Manufacturer Part Number: 686 110 144 22; ComponentHeight: 3.15mm; HelpURL: \\cern.ch\dfs\Applications\Altium\Datasheets\WURTH_686 110 144 22.pdf; Author: CERN DEM JMW; CreateDate: 06.08.2015; LatestRevisionDate: 06.08.2015
TP7 TP8 = TP: Testpoint

## Sheet USB_Hub_AMCbox.SchDoc: USB
size 420 x 297 mm; Author: G.Kasprowicz; CompanyName: WUT ISE; DrawnBy: G.Kasprowicz; Organization: WUT ISE; Address1: PW ISE; Address2: Nowowiejska 15/19 00-665 Warsaw; Address3: gkasprow@gmail.com; DocumentNumber: 13; Revision: 2; SheetNumber: 13; SheetTotal: 18; ModifiedBy: -; CheckedDate: -; Title2: Hub; DivGrp: WUT ISE; Designer: G.Kasprowicz; ModifiedDate: -; ProjectName: Sensor Box
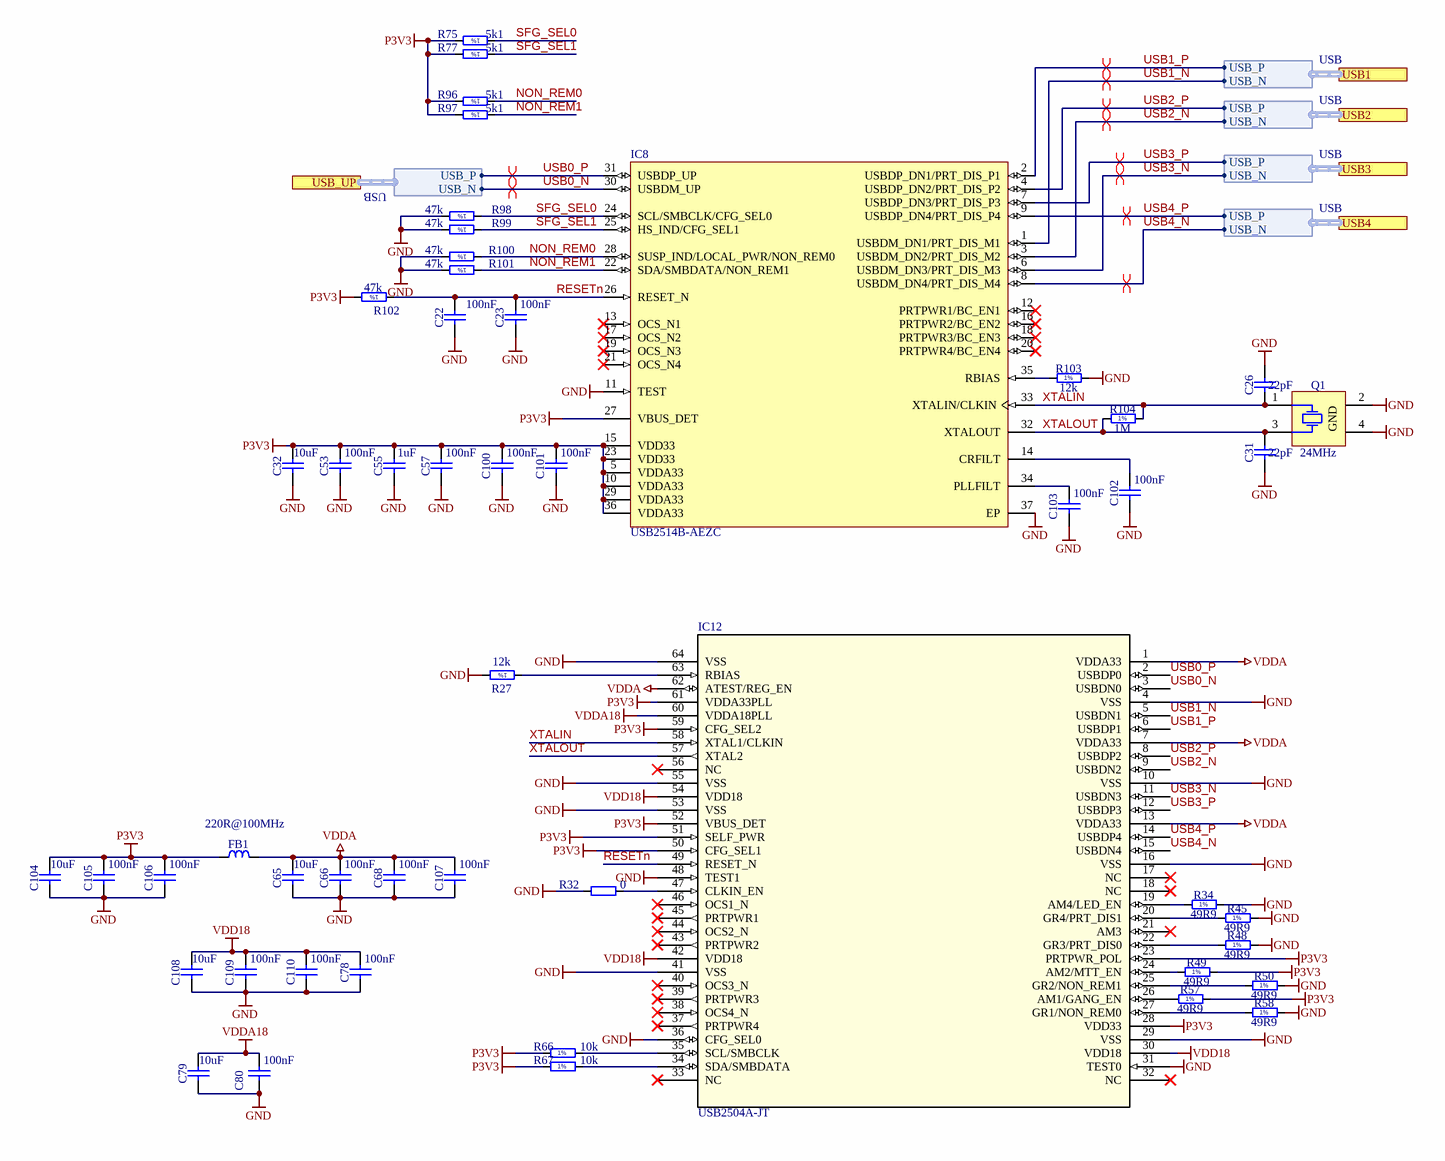
[diagram p12: USB_Hub_AMCbox.SchDoc]

### Parts
C22  100nF  [CAPC0603X33N]
C23  100nF  [CAPC0603X33N]
C26  22pF  [CAPC1005X55N]
C31  22pF  [CAPC1005X55N]
C32  10uF  [CAPC1608X80N]
C53  100nF  [CAPC0603X33N]
C55  1uF  [CAPC1005X55N]
C57  100nF  [CAPC0603X33N]
C65  10uF  [CAPC1608X80N]
C66  100nF  [CAPC0603X33N]
C68  100nF  [CAPC0603X33N]
C78  100nF  [CAPC0603X33N]
C79  10uF  [CAPC1608X80N]
C80  100nF  [CAPC0603X33N]
C100  100nF  [CAPC0603X33N]
C101  100nF  [CAPC0603X33N]
C102  100nF  [CAPC0603X33N]
C103  100nF  [CAPC0603X33N]
C104  10uF  [CAPC1608X80N]
C105  100nF  [CAPC0603X33N]
C106  100nF  [CAPC0603X33N]
C107  100nF  [CAPC0603X33N]
C108  10uF  [CAPC1608X80N]
C109  100nF  [CAPC0603X33N]
C110  100nF  [CAPC0603X33N]
FB1  220R@100MHz  [INDC2012X105N]
IC8  USB2514B-AEZC  [MCHP-QFN-36_V]
IC12  USB2504A-JT  [TQFP64_10x10MC_MCH]
Q1  24MHz  [XTAL_PERICOM_FL]
R27  12k  [RESC1005X40N]
R32  0  [RESC1005X40N]
R34  49R9  [RESC1005X40N]
R45  49R9  [RESC1005X40N]
R48  49R9  [RESC1005X40N]
R49  49R9  [RESC1005X40N]
R50  49R9  [RESC1005X40N]
R57  49R9  [RESC1005X40N]
R58  49R9  [RESC1005X40N]
R66  10k  [RESC1005X40N]
R67  10k  [RESC1005X40N]
R75  5k1  [RESC1005X40N]
R77  5k1  [RESC1005X40N]
R96  5k1  [RESC1005X40N]
R97  5k1  [RESC1005X40N]
R98  47k  [RESC1005X40N]
R99  47k  [RESC1005X40N]
R100  47k  [RESC1005X40N]
R101  47k  [RESC1005X40N]
R102  47k  [RESC1005X40N]
R103  12k  [RESC1005X40N]
R104  1M  [RESC1005X40N]

### Ports
USB1 (harness USB), USB2 (harness USB), USB3 (harness USB), USB4 (harness USB), USB_UP (harness USB)

### Harnesses
USB: USB_N, USB_P

### Nets
GND: C22.1 C23.1 C26.2 C31.1 C32.1 C53.1 C55.1 C57.1 C65.1 C66.1 C68.1 C78.1 C79.1 C80.1 C100.1 C101.1 C102.1 C103.1 C104.1 C105.1 C106.1 C107.1 C108.1 C109.1 C110.1 IC8.11(TEST) IC8.37(EP) IC12.4(VSS) IC12.10(VSS) IC12.16(VSS) IC12.29(VSS) IC12.31(TEST0) IC12.36(CFG_SEL0) IC12.41(VSS) IC12.48(TEST1) IC12.53(VSS) IC12.55(VSS) IC12.64(VSS) Q1.2(GND) Q1.4(GND) R27.2 R32.1 R34.2 R45.2 R48.2 R50.2 R58.2 R98.2 R99.2 R100.2 R101.2 R103.2
P3V3: C32.2 C53.2 C55.2 C57.2 C100.2 C101.2 C104.2 C105.2 C106.2 FB1.1 IC8.5(VDDA33) IC8.10(VDDA33) IC8.15(VDD33) IC8.23(VDD33) IC8.27(VBUS_DET) IC8.29(VDDA33) IC8.36(VDDA33) IC12.23(PRTPWR_POL) IC12.28(VDD33) IC12.50(CFG_SEL1) IC12.51(SELF_PWR) IC12.52(VBUS_DET) IC12.59(CFG_SEL2) IC12.61(VDDA33PLL) R49.2 R57.2 R66.1 R67.1 R75.2 R77.2 R96.2 R97.2 R102.2
VDD18: C78.2 C108.2 C109.2 C110.2 IC12.30(VDD18) IC12.42(VDD18) IC12.54(VDD18)
VDDA: C65.2 C66.2 C68.2 C107.2 FB1.2 IC12.1(VDDA33) IC12.7(VDDA33) IC12.13(VDDA33) IC12.62(ATEST/REG_EN)
VDDA18: C79.2 C80.2 IC12.60(VDDA18PLL)
NON_REM0: IC8.28(SUSP_IND/LOCAL_PWR/NON_REM0) R96.1 R100.1
NON_REM1: IC8.22(SDA/SMBDATA/NON_REM1) R97.1 R101.1
RESETn: C22.2 C23.2 IC8.26(RESET_N) IC12.49(RESET_N) R102.1
SFG_SEL0: IC8.24(SCL/SMBCLK/CFG_SEL0) R75.1 R98.1
SFG_SEL1: IC8.25(HS_IND/CFG_SEL1) R77.1 R99.1
USB0_N: IC8.30(USBDM_UP) IC12.3(USBDN0) ; port USB_UP.USB_N
USB0_P: IC8.31(USBDP_UP) IC12.2(USBDP0) ; port USB_UP.USB_P
USB1_N: IC8.1(USBDM_DN1/PRT_DIS_M1) IC12.5(USBDN1) ; port USB1.USB_N
USB1_P: IC8.2(USBDP_DN1/PRT_DIS_P1) IC12.6(USBDP1) ; port USB1.USB_P
USB2_N: IC8.3(USBDM_DN2/PRT_DIS_M2) IC12.9(USBDN2) ; port USB2.USB_N
USB2_P: IC8.4(USBDP_DN2/PRT_DIS_P2) IC12.8(USBDP2) ; port USB2.USB_P
USB3_N: IC8.6(USBDM_DN3/PRT_DIS_M3) IC12.11(USBDN3) ; port USB3.USB_N
USB3_P: IC8.7(USBDP_DN3/PRT_DIS_P3) IC12.12(USBDP3) ; port USB3.USB_P
USB4_N: IC8.8(USBDM_DN4/PRT_DIS_M4) IC12.15(USBDN4) ; port USB4.USB_N
USB4_P: IC8.9(USBDP_DN4/PRT_DIS_P4) IC12.14(USBDP4) ; port USB4.USB_P
XTALIN: C26.1 IC8.33(XTALIN/CLKIN) IC12.58(XTAL1/CLKIN) Q1.1(X) R104.2
XTALOUT: C31.2 IC8.32(XTALOUT) IC12.57(XTAL2) Q1.3(X) R104.1
NetC102_2: C102.2 IC8.14(CRFILT)
NetC103_2: C103.2 IC8.34(PLLFILT)
NetIC8_35: IC8.35(RBIAS) R103.1
NetIC12_19: IC12.19(AM4/LED_EN) R34.1
NetIC12_20: IC12.20(GR4/PRT_DIS1) R45.1
NetIC12_22: IC12.22(GR3/PRT_DIS0) R48.1
NetIC12_24: IC12.24(AM2/MTT_EN) R49.1
NetIC12_25: IC12.25(GR2/NON_REM1) R50.1
NetIC12_26: IC12.26(AM1/GANG_EN) R57.1
NetIC12_27: IC12.27(GR1/NON_REM0) R58.1
NetIC12_34: IC12.34(SDA/SMBDATA) R67.2
NetIC12_35: IC12.35(SCL/SMBCLK) R66.2
NetIC12_47: IC12.47(CLKIN_EN) R32.2
NetIC12_63: IC12.63(RBIAS) R27.1

Not connected (* = marked no-connect by the designer): IC8 12(PRTPWR1/BC_EN1)* 13(OCS_N1)* 16(PRTPWR2/BC_EN2)* 17(OCS_N2)* 18(PRTPWR3/BC_EN3)* 19(OCS_N3)* 20(PRTPWR4/BC_EN4)* 21(OCS_N4)*; IC12 17(NC)* 18(NC)* 21(AM3)* 32(NC)* 33(NC)* 37(PRTPWR4)* 38(OCS4_N)* 39(PRTPWR3)* 40(OCS3_N)* 43(PRTPWR2)* 44(OCS2_N)* 45(PRTPWR1)* 46(OCS1_N)* 56(NC)*

### Layout directives
differential pair: USB0_N, USB0_P, USB1_N, USB1_P, USB2_N, USB2_P, USB3_N, USB3_P, USB4_N, USB4_P

### Notes on the sheet
- Project/Equipment
- Document
- Designer
- Drawn by
- Check.by
- Copyright WUT ISE 2020.
  This documentation describes Open Hardware and is licensed under the CERN OHL v.1.2. You may redistribute and modify this documentation under the terms of the CERN OHL v.1.2. (http://ohwr.org/CERNOHL). This documentation is distributed WITHOUT ANY EXPRESS OR IMPLIED WARRANTY, INCLUDING OF MERCHANTABILITY, SATISFACTORY QUALITY AND FITNESS FOR A PARTICULAR PURPOSE. Please see the CERN OHL v.1.2 for applicable conditions.
- Contact
- File
- Last Mod.
- Print Date
- Sheet
- Size
- A3
- of
- Rev
- (in symbol R0402_1M_1%_0.0625W_100PPM) 1%
- (in symbol R0402_5K1_1%_0.0625W_100PPM) 1%
- (in symbol R0402_10K_1%_0.0625W_100PPM) 1%
- (in symbol R0402_12K_1%_0.0625W_100PPM) 1%
- (in symbol R0402_47K_1%_0.0625W_100PPM) 1%
- (in symbol R0402_49R9_1%_0.0625W_100PPM) 1%

### Library data of the parts
C22 C23 C53 C57 C66 C68 C78 C80 C100-C103 C105-C107 C109 C110 = CC0201_100NF_6.3V_10%_X5R: Non-polarised capacitor; Part Description: SMD Multilayer Chip Ceramic Capacitor; Manufacturer: GENERIC; Manufacturer1 Part Number: 02016D104KAT2A; Voltage: 6.3V; TC: X5R; Tolerance: ±10%; Part Number: CC0201_100NF_6.3V_10%_X5R; Component Kind: Standard; Component Type: Standard; Pin Count: 2; Value: 100nF; Status: Not Recommended; Manufacturer Part Number: CC0201_100NF_6.3V_10%_X5R; Case: 0201; Mounted: Yes; Socket: No; SMD: Yes; Sense: No; Manufacturer1 Example: AVX; Manufacturer1 ComponentHeight: 0.33mm; HelpURL: \\cern.ch\dfs\Applications\Altium\Datasheets\CC0201_X5R_AVX.pdf; Author: CERN DEM JLC; CreateDate: 03/12/2007; LatestRevisionDate: 03/12/2007
C26 C31 = CC0402_22PF_50V_5%_C0G: Non-polarised capacitor; Part Description: SMD Multilayer Chip Ceramic Capacitor; Manufacturer: GENERIC; Manufacturer1 Part Number: C0402C220J5GACTU; Voltage: 50V; TC: C0G/NP0; Tolerance: ±5%; Part Number: CC0402_22PF_50V_5%_C0G; Component Kind: Standard; Component Type: Standard; Pin Count: 2; Value: 22pF; Status: Preferred; Manufacturer Part Number: CC0402_22PF_50V_5%_C0G; Case: 0402; Mounted: Yes; Socket: No; SMD: Yes; Sense: No; Manufacturer1 Example: KEMET; Manufacturer1 ComponentHeight: 0.55mm; HelpURL: \\cern.ch\dfs\Applications\Altium\Datasheets\CC0402_C0G_KEMET_(Commercial Grade).pdf; Author: CERN DEM JLC; CreateDate: 03/12/2007; LatestRevisionDate: 03/12/2007
C32 C65 C79 C104 C108 = CC0603_10UF_16V_20%_X5R: Non-polarised capacitor; Part Description: SMD Multilayer Chip Ceramic Capacitor; Manufacturer: GENERIC; Manufacturer1 Part Number: GRM188R61C106MA73D; Voltage: 16V; TC: X5R; Tolerance: ±20%; Part Number: CC0603_10UF_16V_20%_X5R; Component Kind: Standard; Component Type: Standard; Pin Count: 2; Value: 10uF; Status: None; Manufacturer Part Number: CC0603_10UF_16V_20%_X5R; Case: 0603; Mounted: Yes; Socket: No; SMD: Yes; Sense: No; Manufacturer1 Example: MURATA; Manufacturer1 ComponentHeight: 0.8mm; HelpURL: \\cern.ch\dfs\Applications\Altium\Datasheets\CC0603_X5R_MURATA_GRM.pdf; Author: CERN DEM MR; CreateDate: 02/03/2016; LatestRevisionDate: 02/03/2016
C55 = CC0402_1UF_16V_10%_X5R: Non-polarised capacitor; Part Description: SMD Multilayer Chip Ceramic Capacitor; Manufacturer: GENERIC; Manufacturer1 Part Number: C1005X5R1C105KT; Voltage: 16V; TC: X5R; Tolerance: ±10%; Part Number: CC0402_1UF_16V_10%_X5R; Component Kind: Standard; Component Type: Standard; Pin Count: 2; Value: 1uF; Status: Preferred; Manufacturer Part Number: CC0402_1UF_16V_10%_X5R; Case: 0402; Mounted: Yes; Socket: No; SMD: Yes; Sense: No; Manufacturer1 Example: TDK; Manufacturer1 ComponentHeight: 0.55mm; HelpURL: \\cern.ch\dfs\Applications\Altium\Datasheets\CC0402_X5R_TDK_C.pdf; Author: CERN DEM JLC; CreateDate: 25/10/2012; LatestRevisionDate: 25/10/2012
FB1 = IND0805_MURATA_BLM21PG221SN1D: Inductor; Part Description: SMD EMIFIL Suppression Chip Ferrite Bead; Manufacturer: MURATA; Power: 2A; Resistance: 0.05R; Tolerance: ±25%; Table: Inductors SMD; Part Number: IND0805_MURATA_BLM21PG221SN1D; Component Kind: Standard; Component Type: Standard; Pin Count: 2; Value: 220R@100MHz; Status: None; Manufacturer Part Number: BLM21PG221SN1D; Case: 0805; Mounted: Yes; Socket: No; SMD: Yes; ComponentHeight: 1.05mm; HelpURL: \\cern.ch\dfs\Applications\Altium\Datasheets\IND0402_MURATA_BLM21P.pdf; Author: CERN DEM JLC; CreateDate: 2010-01-25; LatestRevisionDate: 2010-01-25
IC8 = CMP-2000-05217-1: USB 2.0 High-Speed Hub Controller, 4 Ports, 3 to 3.6 V, 0 to 85 degC, 36-Pin QFN, RoHS, Tray; Manufacturer: Microchip; Interface: I²CEEPROM,SMBus(2-Wire,I²C); Other Names: 638-1122; Voltage - Supply: 3V~3.6V; Current - Supply: 70mA; Manufacturer URL: http://www.microchip.com/; Packaging: Tray; Function: -; Standards: -; Category: IntegratedCircuits(ICs); Package / Case: 36-VFQFNExposedPad; Supplier Device Package: 36-QFN(6x6); Family: Interface-Controllers; Datasheet Version: DS00001692C, 10/2015; Standard Package: 490; Series: -; Protocol: -; Datasheet URL: http://ww1.microchip.com/downloads/en/DeviceDoc/00001692C.pdf; Operating Temperature: -
IC12 = IFC_USB2504A-JT: Integrated USB 2.0 Compatible 4-Port Hub; Manufacturer: Microchip; Copyright: Copyright (C) 2022 Ultra Librarian. All rights reserved.; Manufacturer Part Number: USB2504A-JT; RefDes: RefDes; Type: DEV
Q1 = XTAL_24MHZ_PERICOM_FL2400041: Crystal 4 pins 1=XTAL Control 2=GND3=XTAL 4=GND; Part Description: Tolerance: ±30ppm, Stability: ±30ppm, -20°C to +70°C, 18pF, SMD Seam Sealing Crystal, FL Series; PressFit: No; Bonding: No; Part Number: XTAL_24MHZ_PERICOM_FL2400041; Component Kind: Standard; Component Type: Standard; PackageDescription: 4 Pins, 2.5x3.2mm, SMD Sealing Crystal, PERICOM FL Series; Value: 24MHz; Manufacturer: PERICOM; Manufacturer Part Number: FL2400041; Pin Count: 2; Mounted: Yes; Socket: No; SMD: Yes; Sense: No; ComponentHeight: 0.75mm; HelpURL: \\cern.ch\dfs\Applications\Altium\Datasheets\XTAL_PERICOM_FL2400041.pdf; Author: CERN DEM JLC; CreateDate: 04/10/2016; LatestRevisionDate: 04/10/2016
R27 R103 = R0402_12K_1%_0.0625W_100PPM: Resistor - 1%; Part Description: General Purpose Thick Film Chip Resistor; Manufacturer: GENERIC; Manufacturer1 Part Number: 232270671203L; TC: ±100ppm/°C; PressFit: No; Part Number: R0402_12K_1%_0.0625W_100PPM; Component Kind: Standard; Component Type: Standard; Pin Count: 2; Value: 12k; Status: Not Recommended; Power: 0.0625W; Tolerance: ±1%; Manufacturer Part Number: R0402_12K_1%_0.0625W_100PPM; Case: 0402; Mounted: Yes; Sense: No; Socket: No; SMD: Yes; Manufacturer1 Example: YAGEO PHYCOMP; Manufacturer1 ComponentHeight: 0.4mm; HelpURL: \\cern.ch\dfs\Applications\Altium\Datasheets\R0402_Phycomp_RC0402.pdf; Author: CERN DEM JLC; CreateDate: 03/12/2007; LatestRevisionDate: 17/10/2012
R32 = R0402_0R_JUMPER: as R1#2 on sheet CPU_ETH; Part Number: R0402_0R_JUMPER; Component Kind: Standard; Component Type: Standard; Pin Count: 2; Value: 0; Status: Not Recommended; Manufacturer Part Number: R0402_0R_JUMPER; Case: 0402; Mounted: Yes; Socket: No; SMD: Yes; Manufacturer1 Example: YAGEO PHYCOMP; Manufacturer1 ComponentHeight: 0.4mm; HelpURL: \\cern.ch\dfs\Applications\Altium\Datasheets\R0402_Phycomp_RC0402.pdf; Author: CERN DEM JLC; CreateDate: 03.12.2007; LatestRevisionDate: 17.10.2012; Sense: No
R34 R45 R48-R50 R57 R58 = R0402_49R9_1%_0.0625W_100PPM: as R38 on sheet Thermal_MGT; Part Number: R0402_49R9_1%_0.0625W_100PPM; Component Kind: Standard; Component Type: Standard; Pin Count: 2; Value: 49R9; Status: Not recommended; Power: 0.0625W; Tolerance: ±1%; Manufacturer Part Number: R0402_49R9_1%_0.0625W_100PPM; Case: 0402; Mounted: Yes; Socket: No; SMD: Yes; Manufacturer1 Example: YAGEO PHYCOMP; Manufacturer1 ComponentHeight: 0.4mm; HelpURL: \\cern.ch\dfs\Applications\Altium\Datasheets\R0402_Phycomp_RC0402.pdf; Author: CERN DEM JLC; CreateDate: 2012-10-24; LatestRevisionDate: 2012-10-24
R66 R67 = R0402_10K_1%_0.0625W_100PPM: as R147-R150 on sheet Thermal_MGT; Part Number: R0402_10K_1%_0.0625W_100PPM; Component Kind: Standard; Component Type: Standard; Pin Count: 2; Value: 10k; Status: Not recommended; Power: 0.0625W; Tolerance: ±1%; Manufacturer Part Number: R0402_10K_1%_0.0625W_100PPM; Case: 0402; Mounted: Yes; Socket: No; SMD: Yes; Manufacturer1 Example: YAGEO PHYCOMP; Manufacturer1 ComponentHeight: 0.4mm; HelpURL: \\cern.ch\dfs\Applications\Altium\Datasheets\R0402_Phycomp_RC0402.pdf; Author: CERN DEM JLC; CreateDate: 2007-12-03; LatestRevisionDate: 2012-10-17
R75 R77 R96 R97 = R0402_5K1_1%_0.0625W_100PPM: Resistor - 1%; Part Description: General Purpose Thick Film Chip Resistor; Manufacturer: GENERIC; Manufacturer1 Part Number: 232270675102L; TC: ±100ppm/°C; PressFit: No; Part Number: R0402_5K1_1%_0.0625W_100PPM; Component Kind: Standard; Component Type: Standard; Pin Count: 2; Value: 5k1; Status: Not Recommended; Power: 0.0625W; Tolerance: ±1%; Manufacturer Part Number: R0402_5K1_1%_0.0625W_100PPM; Case: 0402; Mounted: Yes; Sense: No; Socket: No; SMD: Yes; Manufacturer1 Example: YAGEO PHYCOMP; Manufacturer1 ComponentHeight: 0.4mm; HelpURL: \\cern.ch\dfs\Applications\Altium\Datasheets\R0402_Phycomp_RC0402.pdf; Author: CERN DEM JLC; CreateDate: 03/12/2007; LatestRevisionDate: 17/10/2012
R98-R102 = R0402_47K_1%_0.0625W_100PPM: Resistor - 1%; Manufacturer: GENERIC; Part Description: General Purpose Thick Film Chip Resistor; Manufacturer1 Part Number: 232270675103L; TC: ±100ppm/°C; PressFit: No; Manufacturer Part Number: R0402_47K_1%_0.0625W_100PPM; Part Number: R0402_47K_1%_0.0625W_100PPM; Tolerance: ±1%; Value: 47k; Component Kind: Standard; Component Type: Standard; Pin Count: 2; Status: Not Recommended; Power: 0.0625W; Case: 0402; Mounted: Yes; Sense: No; Socket: No; SMD: Yes; Manufacturer1 Example: YAGEO PHYCOMP; Manufacturer1 ComponentHeight: 0.4mm; HelpURL: \\cern.ch\dfs\Applications\Altium\Datasheets\R0402_Phycomp_RC0402.pdf; Author: CERN DEM JLC; CreateDate: 03.12.2007; LatestRevisionDate: 17.10.2012
R104 = R0402_1M_1%_0.0625W_100PPM: Resistor - 1%; Part Description: General Purpose Thick Film Chip Resistor; Manufacturer: GENERIC; Manufacturer1 Part Number: 232270671005L; TC: ±100ppm/°C; PressFit: No; Part Number: R0402_1M_1%_0.0625W_100PPM; Component Kind: Standard; Component Type: Standard; Pin Count: 2; Value: 1M; Status: Not Recommended; Power: 0.0625W; Tolerance: ±1%; Manufacturer Part Number: R0402_1M_1%_0.0625W_100PPM; Case: 0402; Mounted: Yes; Sense: No; Socket: No; SMD: Yes; Manufacturer1 Example: YAGEO PHYCOMP; Manufacturer1 ComponentHeight: 0.4mm; HelpURL: \\cern.ch\dfs\Applications\Altium\Datasheets\R0402_Phycomp_RC0402.pdf; Author: CERN DEM JLC; CreateDate: 03/12/2007; LatestRevisionDate: 17/10/2012